# EAGLE schematic NXPESC-UF1_test002 (EAGLE 7.6.0)

## Sheet 1 of 3
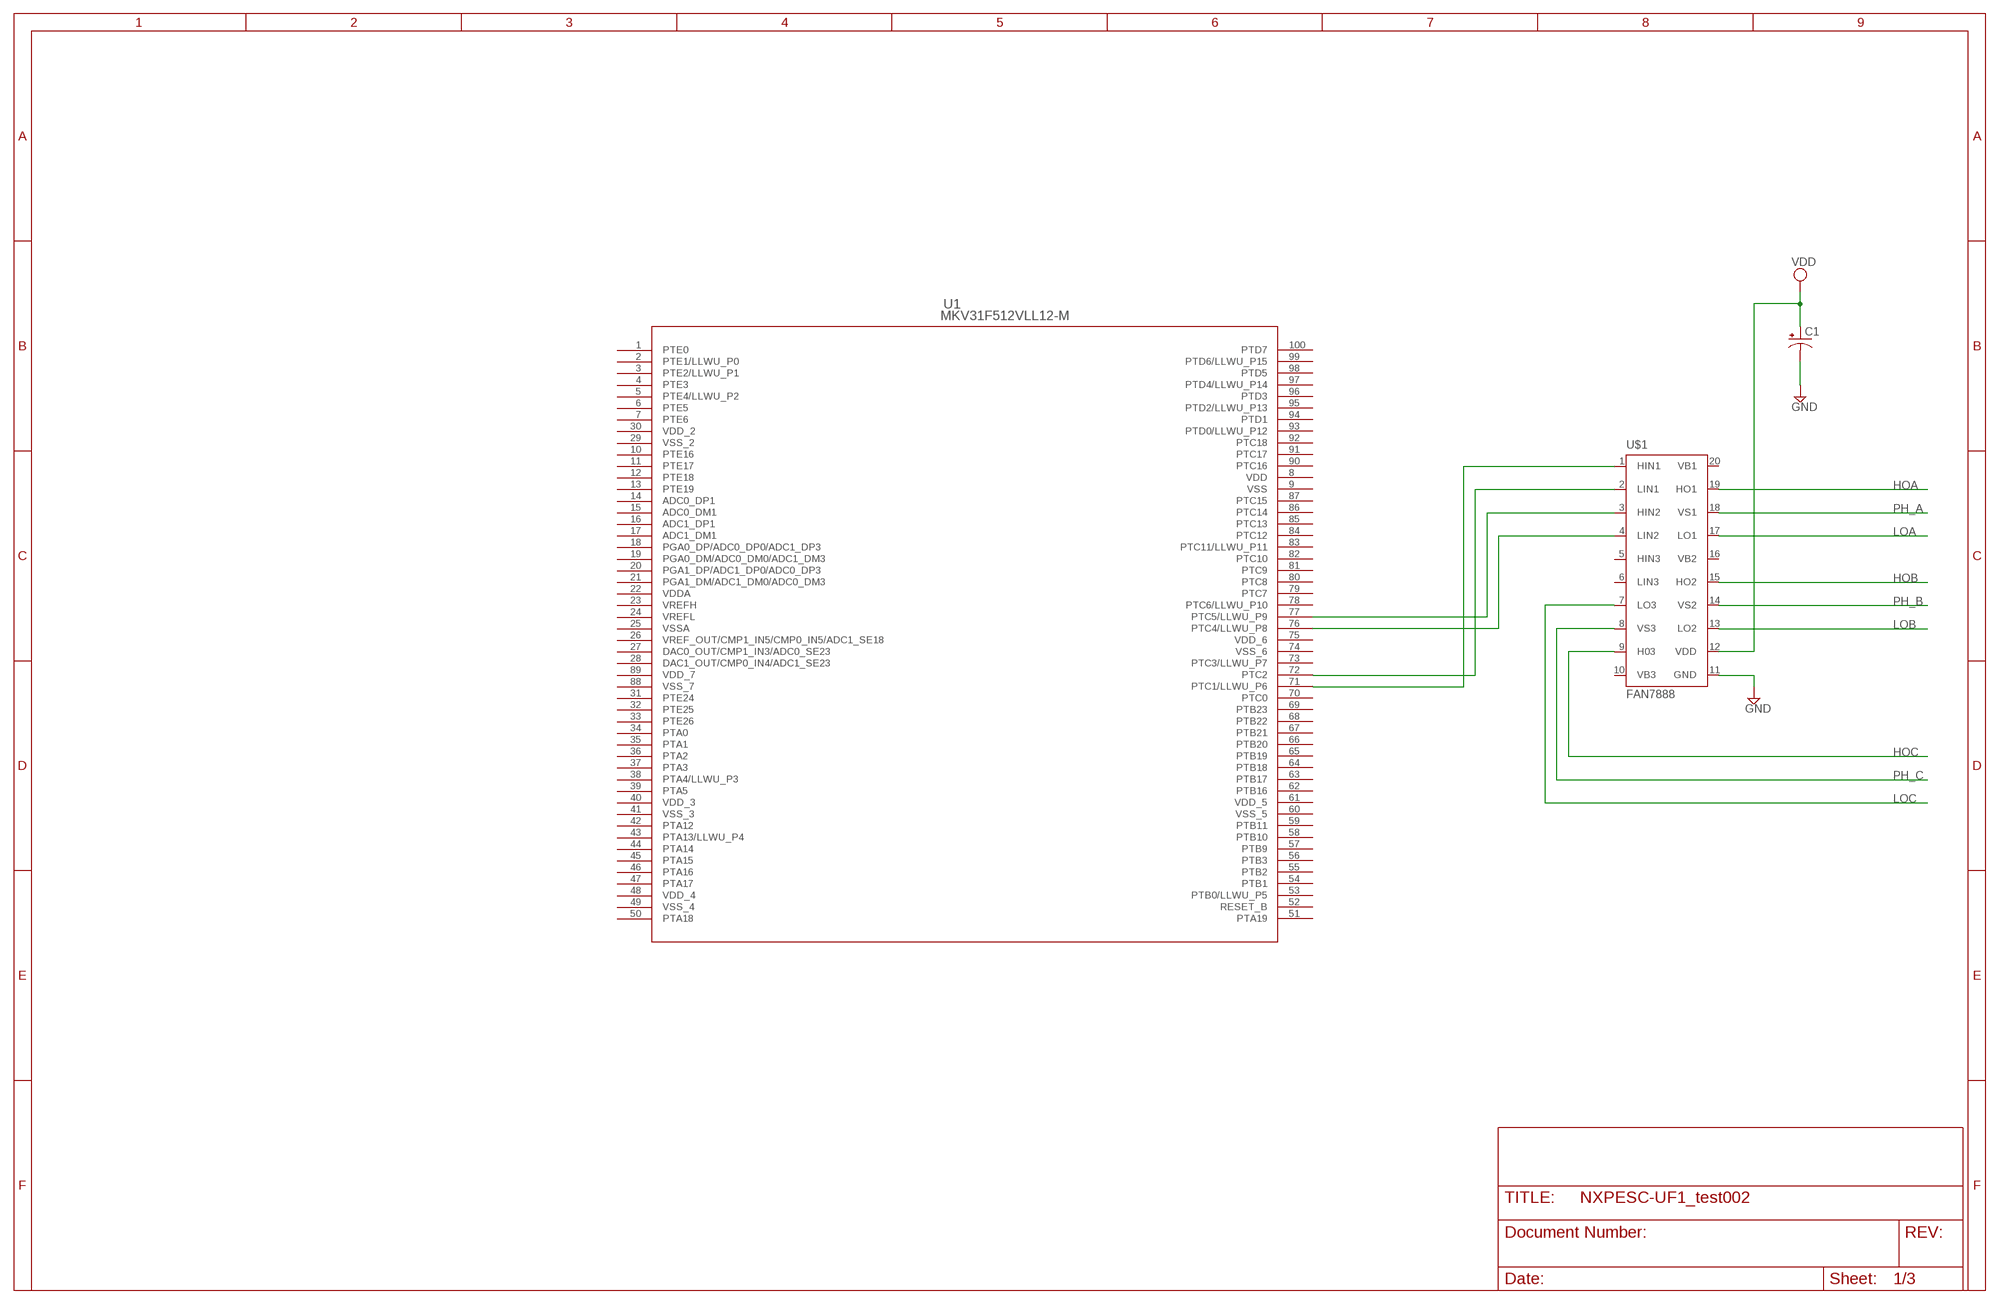
[diagram p0: schematic, sheet 1]

### Parts
C1  CAP_POL1206  [EIA3216]
U1  MKV31F512VLL12-M  [LQFP-100_14X14X1_7-M]
U$1  FAN7888  [SOIC-20]

### Nets
GND: C1.C(-) U$1.11(GND) ; also sheet 2
HOA: U$1.19(HO1) ; also sheet 2
HOB: U$1.15(HO2) ; also sheet 2
HOC: U$1.9(H03) ; also sheet 2
LOA: U$1.17(LO1) ; also sheet 2
LOB: U$1.13(LO2) ; also sheet 2
LOC: U$1.7(LO3) ; also sheet 2
N$5: U1.71(PTC1/LLWU_P6) U$1.1(HIN1)
N$6: U1.72(PTC2) U$1.2(LIN1)
N$7: U1.77(PTC5/LLWU_P9) U$1.3(HIN2)
N$8: U1.76(PTC4/LLWU_P8) U$1.4(LIN2)
PH_A: U$1.18(VS1) ; also sheet 2
PH_B: U$1.14(VS2) ; also sheet 2
PH_C: U$1.8(VS3) ; also sheet 2
VDD: C1.A(+) U$1.12(VDD)
Unconnected: U1.1(PTE0) U1.2(PTE1/LLWU_P0) U1.3(PTE2/LLWU_P1) U1.4(PTE3) U1.5(PTE4/LLWU_P2) U1.6(PTE5) U1.7(PTE6) U1.10(PTE16) U1.11(PTE17) U1.12(PTE18) U1.13(PTE19) U1.14(ADC0_DP1) U1.15(ADC0_DM1) U1.16(ADC1_DP1) U1.17(ADC1_DM1) U1.18(PGA0_DP/ADC0_DP0/ADC1_DP3) U1.19(PGA0_DM/ADC0_DM0/ADC1_DM3) U1.20(PGA1_DP/ADC1_DP0/ADC0_DP3) U1.21(PGA1_DM/ADC1_DM0/ADC0_DM3) U1.26(VREF_OUT/CMP1_IN5/CMP0_IN5/ADC1_SE18) U1.27(DAC0_OUT/CMP1_IN3/ADC0_SE23) U1.28(DAC1_OUT/CMP0_IN4/ADC1_SE23) U1.31(PTE24) U1.32(PTE25) U1.33(PTE26) U1.34(PTA0) U1.35(PTA1) U1.36(PTA2) U1.37(PTA3) U1.38(PTA4/LLWU_P3) U1.39(PTA5) U1.42(PTA12) U1.43(PTA13/LLWU_P4) U1.44(PTA14) U1.45(PTA15) U1.46(PTA16) U1.47(PTA17) U1.50(PTA18) U1.51(PTA19) U1.52(RESET_B) U1.53(PTB0/LLWU_P5) U1.54(PTB1) U1.55(PTB2) U1.56(PTB3) U1.57(PTB9) U1.58(PTB10) U1.59(PTB11) U1.62(PTB16) U1.63(PTB17) U1.64(PTB18) U1.65(PTB19) U1.66(PTB20) U1.67(PTB21) U1.68(PTB22) U1.69(PTB23) U1.70(PTC0) U1.73(PTC3/LLWU_P7) U1.78(PTC6/LLWU_P10) U1.79(PTC7) U1.80(PTC8) U1.81(PTC9) U1.82(PTC10) U1.83(PTC11/LLWU_P11) U1.84(PTC12) U1.85(PTC13) U1.86(PTC14) U1.87(PTC15) U1.90(PTC16) U1.91(PTC17) U1.92(PTC18) U1.93(PTD0/LLWU_P12) U1.94(PTD1) U1.95(PTD2/LLWU_P13) U1.96(PTD3) U1.97(PTD4/LLWU_P14) U1.98(PTD5) U1.99(PTD6/LLWU_P15) U1.100(PTD7) U$1.5(HIN3) U$1.6(LIN3)

## Sheet 2 of 3
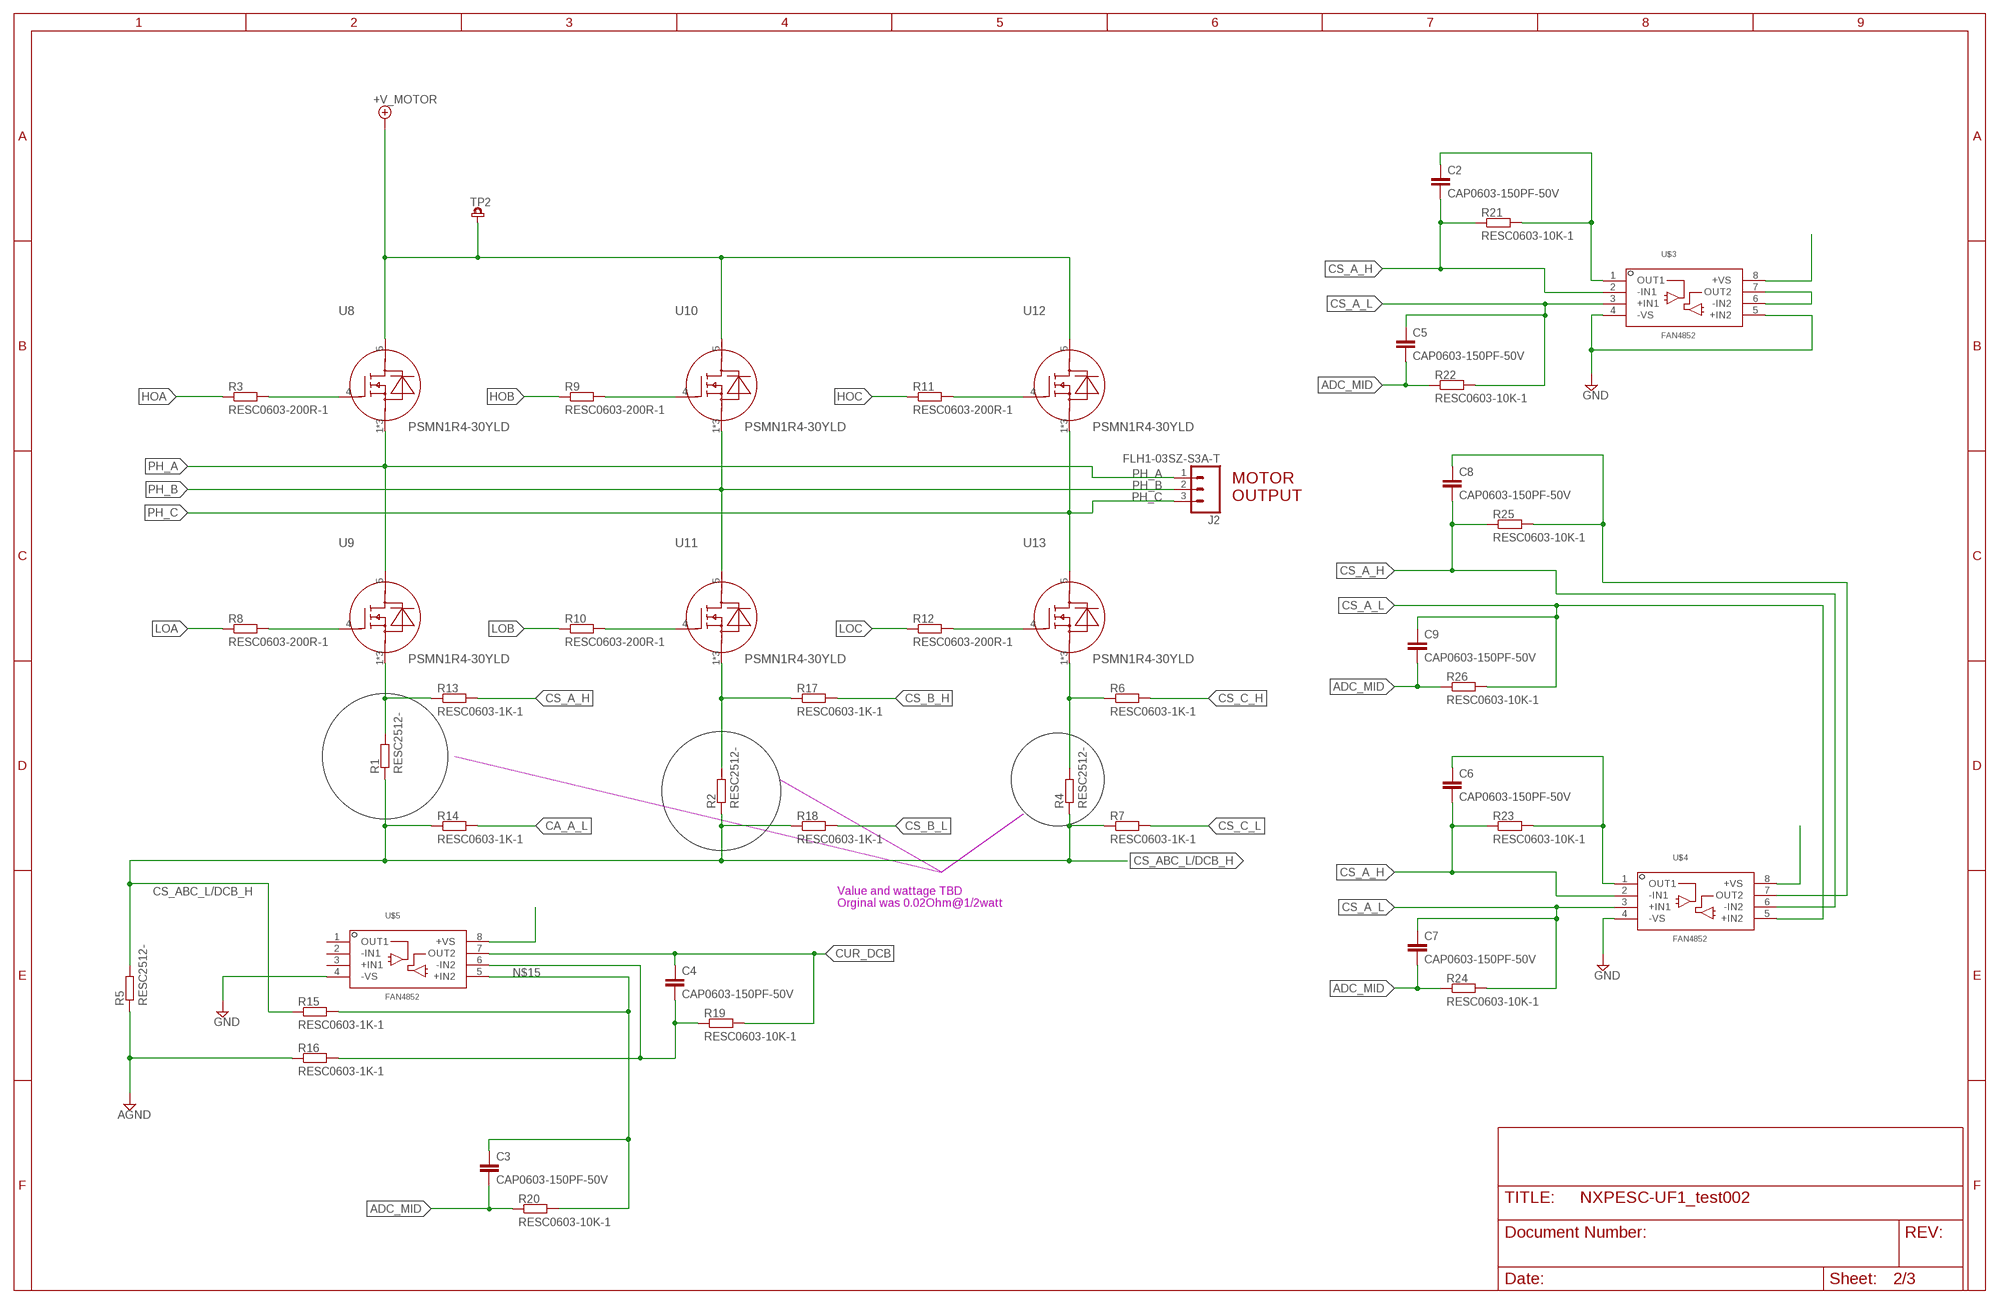
[diagram p1: schematic, sheet 2]

### Parts
C2  CAP0603-150PF-50V  [C0603]
C3  CAP0603-150PF-50V  [C0603]
C4  CAP0603-150PF-50V  [C0603]
C5  CAP0603-150PF-50V  [C0603]
C6  CAP0603-150PF-50V  [C0603]
C7  CAP0603-150PF-50V  [C0603]
C8  CAP0603-150PF-50V  [C0603]
C9  CAP0603-150PF-50V  [C0603]
J2  FLH1-03SZ-S3A-T  [J3]
R1  RESC2512-  [R2512]
R2  RESC2512-  [R2512]
R3  RESC0603-200R-1  [C0603]
R4  RESC2512-  [R2512]
R5  RESC2512-  [R2512]
R6  RESC0603-1K-1  [C0603]
R7  RESC0603-1K-1  [C0603]
R8  RESC0603-200R-1  [C0603]
R9  RESC0603-200R-1  [C0603]
R10  RESC0603-200R-1  [C0603]
R11  RESC0603-200R-1  [C0603]
R12  RESC0603-200R-1  [C0603]
R13  RESC0603-1K-1  [C0603]
R14  RESC0603-1K-1  [C0603]
R15  RESC0603-1K-1  [C0603]
R16  RESC0603-1K-1  [C0603]
R17  RESC0603-1K-1  [C0603]
R18  RESC0603-1K-1  [C0603]
R19  RESC0603-10K-1  [C0603]
R20  RESC0603-10K-1  [C0603]
R21  RESC0603-10K-1  [C0603]
R22  RESC0603-10K-1  [C0603]
R23  RESC0603-10K-1  [C0603]
R24  RESC0603-10K-1  [C0603]
R25  RESC0603-10K-1  [C0603]
R26  RESC0603-10K-1  [C0603]
TP2  TP-TH-SMLL  [TP-SMLL]
U8  PSMN1R4-30YLD  [LFPAK56]
U9  PSMN1R4-30YLD  [LFPAK56]
U10  PSMN1R4-30YLD  [LFPAK56]
U11  PSMN1R4-30YLD  [LFPAK56]
U12  PSMN1R4-30YLD  [LFPAK56]
U13  PSMN1R4-30YLD  [LFPAK56]
U$3  FAN4852  [SOP65P490X110-8N]
U$4  FAN4852  [SOP65P490X110-8N]
U$5  FAN4852  [SOP65P490X110-8N]

### Nets
+V_MOTOR: TP2.1 U8.5(D) U10.5(D) U12.5(D)
ADC_MID: C3.2 C5.2 C7.2 C9.2 R20.1 R22.1 R24.1 R26.1
AGND: R5.1 R16.1
CA_A_L: R14.2
CS_A_H: C2.2 C6.2 C8.2 R13.2 R21.1 R23.1 R25.1 U$3.2(-IN1) U$4.2(-IN1) U$4.6(-IN2)
CS_A_L: C5.1 C7.1 C9.1 R22.2 R24.2 R26.2 U$3.3(+IN1) U$4.3(+IN1) U$4.5(+IN2)
CS_ABC_L/DCB_H: R1.1 R2.1 R4.1 R5.2 R7.1 R14.1 R15.1 R18.1
CS_B_H: R17.2
CS_B_L: R18.2
CS_C_H: R6.2
CS_C_L: R7.2
CUR_DCB: C4.1 R19.2 U$5.7(OUT2)
GND: U$3.4(-VS) U$3.5(+IN2) U$4.4(-VS) U$5.4(-VS) ; also sheet 1
HOA: R3.1 ; also sheet 1
HOB: R9.1 ; also sheet 1
HOC: R11.1 ; also sheet 1
LOA: R8.1 ; also sheet 1
LOB: R10.1 ; also sheet 1
LOC: R12.1 ; also sheet 1
N$1: R3.2 U8.4(G)
N$2: R1.2 R13.1 U9.1(S) U9.2(S) U9.3(S)
N$3: R8.2 U9.4(G)
N$4: R9.2 U10.4(G)
N$9: R10.2 U11.4(G)
N$10: R11.2 U12.4(G)
N$11: R2.2 R17.1 U11.1(S) U11.2(S) U11.3(S)
N$12: R4.2 R6.1 U13.1(S) U13.2(S) U13.3(S)
N$13: U$3.6(-IN2) U$3.7(OUT2)
N$15: C3.1 R15.2 R20.2 U$5.5(+IN2)
N$16: C4.2 R16.2 R19.1 U$5.6(-IN2)
N$17: R12.2 U13.4(G)
N$18: C2.1 R21.2 U$3.1(OUT1)
N$19: U$3.8(+VS)
N$20: U$4.8(+VS)
N$21: C6.1 R23.2 U$4.1(OUT1)
N$22: C8.1 R25.2 U$4.7(OUT2)
N$25: U$5.8(+VS)
PH_A: J2.1 U8.1(S) U8.2(S) U8.3(S) U9.5(D) ; also sheet 1
PH_B: J2.2 U10.1(S) U10.2(S) U10.3(S) U11.5(D) ; also sheet 1
PH_C: J2.3 U12.1(S) U12.2(S) U12.3(S) U13.5(D) ; also sheet 1
Unconnected: U$5.1(OUT1) U$5.2(-IN1) U$5.3(+IN1)

### Notes on the sheet
- MOTOR
  OUTPUT
- Value and wattage TBD
  Orginal was 0.02Ohm@1/2watt

## Sheet 3 of 3
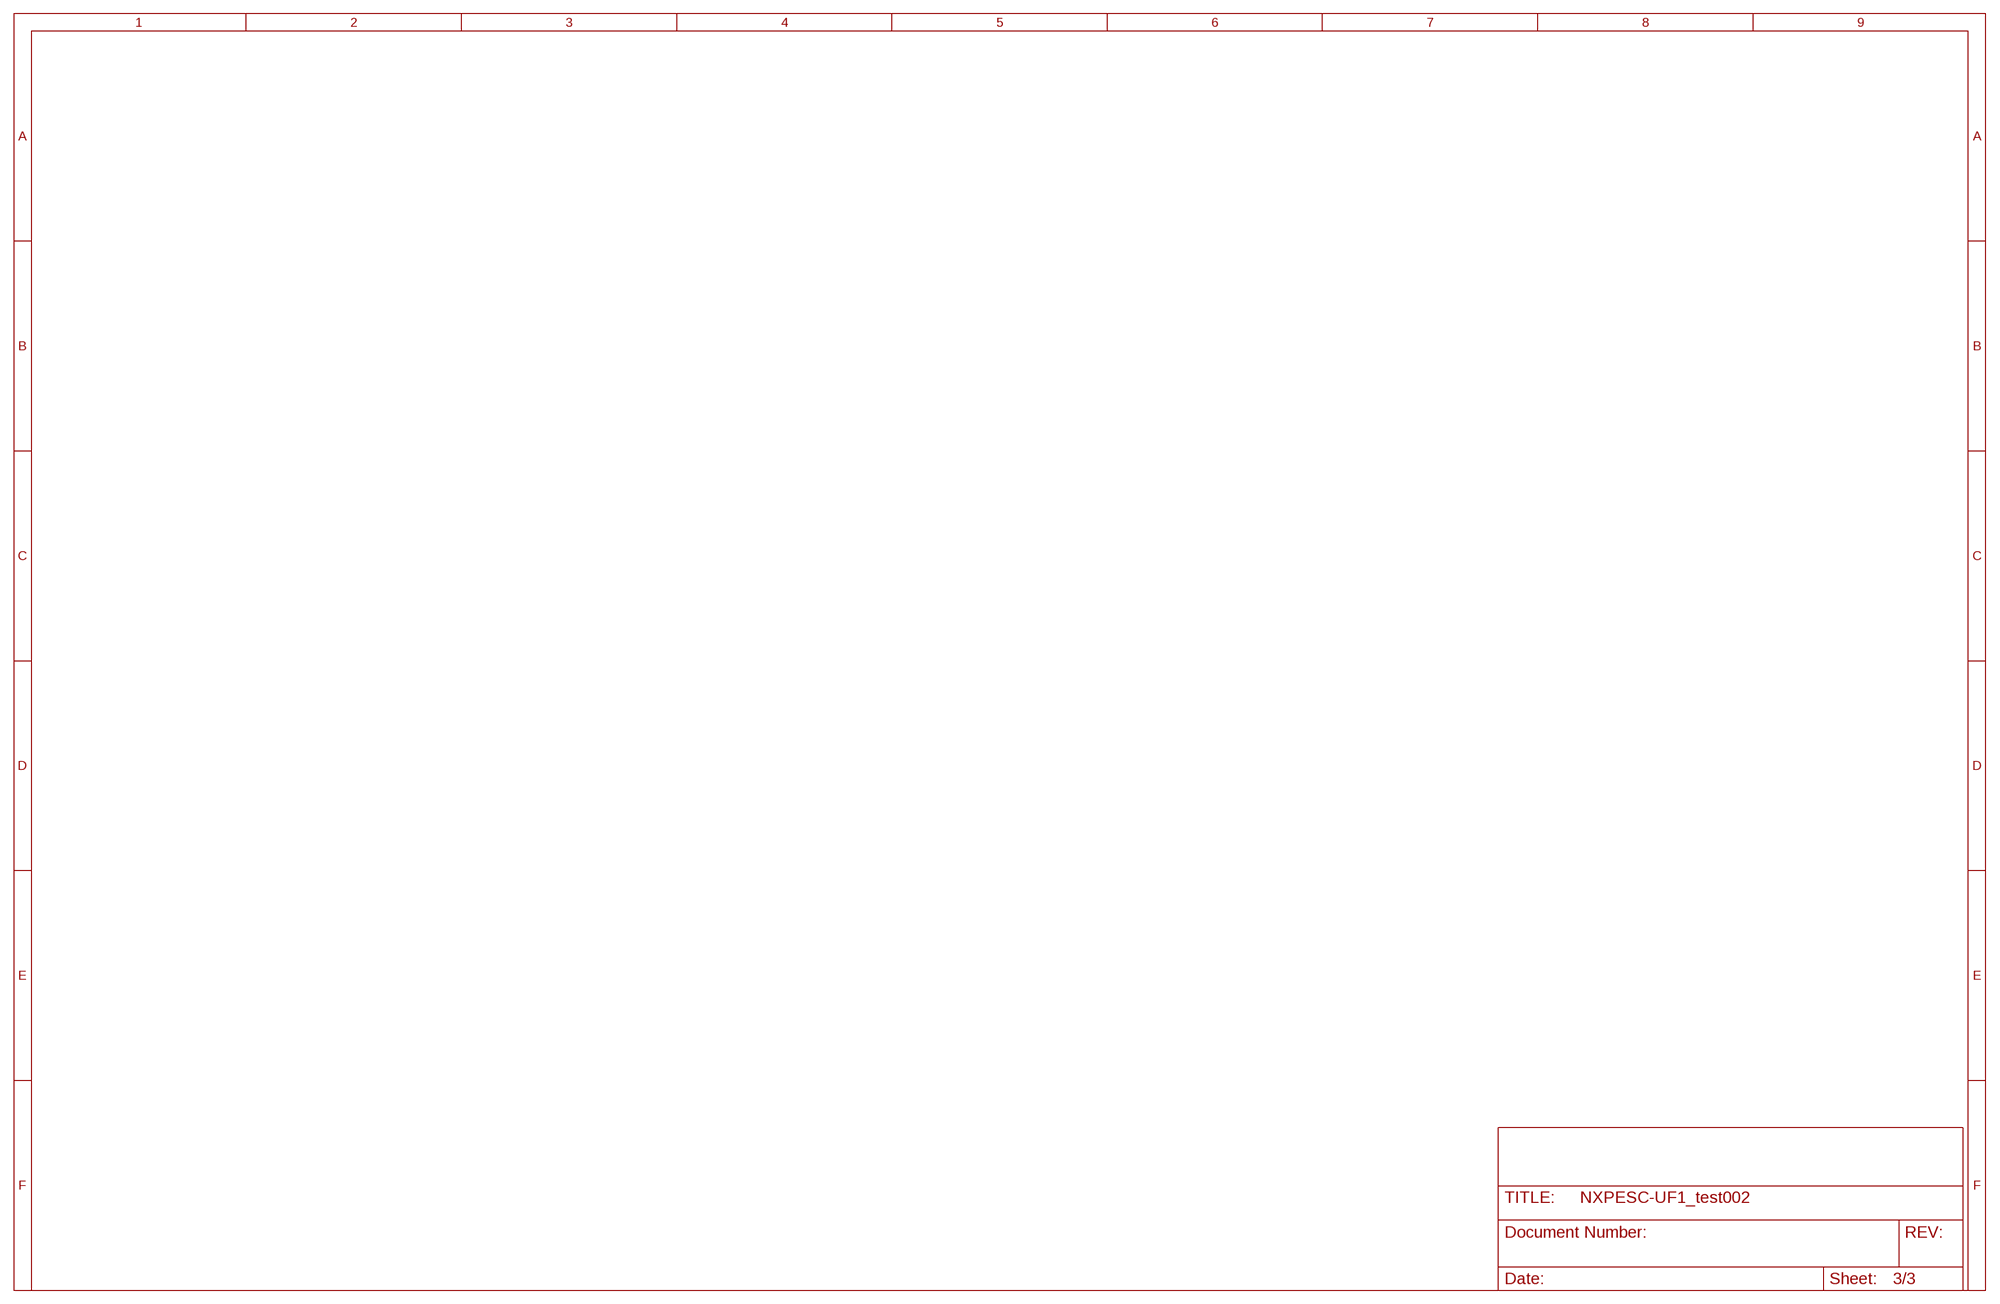
[diagram p2: schematic, sheet 3]

## Power pins joined to a net without a drawn wire
VB1: U$1.20(VB1)
VB2: U$1.16(VB2)
VB3: U$1.10(VB3)
VDD: U1.8(VDD)
VDD_2: U1.30(VDD_2)
VDD_3: U1.40(VDD_3)
VDD_4: U1.48(VDD_4)
VDD_5: U1.61(VDD_5)
VDD_6: U1.75(VDD_6)
VDD_7: U1.89(VDD_7)
VDDA: U1.22(VDDA)
VREFH: U1.23(VREFH)
VREFL: U1.24(VREFL)
VSS: U1.9(VSS)
VSS_2: U1.29(VSS_2)
VSS_3: U1.41(VSS_3)
VSS_4: U1.49(VSS_4)
VSS_5: U1.60(VSS_5)
VSS_6: U1.74(VSS_6)
VSS_7: U1.88(VSS_7)
VSSA: U1.25(VSSA)

## Library data of the parts
C1 = pixhawk2:CAP_POL: Capacitor Polarized These are standard SMD and PTH capacitors. Normally 10uF, 47uF, and 100uF in electrolytic and tantalum varieties. Always verify the external diameter of the through hole cap, it varies with capacity, voltage, and manufacturer. The EIA devices should be standard.
C2-C9 = etc-rcl:CAP?-*: Capacitors with ETC part numbers. package 1812 are actually 1808 Y capacitors
J2 = etc-connector-003a:FLH1-03SZ-S3A-T: Molex 3-pin single row friction lock pin header.
R1-R26 = etc-rcl:RESC?-*: Resistors with ETC part numbers.
TP2 = etc-connector-003a:TP-TH-SMLL
U1 = MKV31F512VLL12:MKV31F512VLL12: The Kinetis KV3x family of MCUs delivers a high-performance solution for BLDC, PMSM and ACIM motor control applications. Built upon the ARM Cortex-M4 core running at 100 or 120 MHz with DSP instruction set and floating point unit, the KV3 devices feature dual 16-bit analog-to-digital converters (ADCs) sampling at up to 1.2 mega samples per second (MSPS) in 12-bit mode, multiple motor control timers, 64 to 512 KB of flash memory and a comprehensive enablement suite from proprietary and third-party resources, including reference designs for ACIM, BLDC and PMSM motor control built on NXP's Embedded Software libraries and motor configuration tools. The KV3x is the first device in the Kinetis V portfolio to be enabled with Kinetis Motor Suite (KMS). KMS is a software solution that enables the rapid configuration of motor drive systems, and accelerates development of the final motor drive application, whilst improving overall motor system performance. KMS simplifies motor control across variable speeds and loads of any type of 3-ph PMSM motor regardless of power level. For more information on Kinetis Motor Suite go to nxp.com/kms
U8-U13 = PSMN1R2-25YL_115:PSMN1R4-30YLD: NXP PSMN1R4
U$1 = FAN7888:FAN7888
U$3-U$5 = NXPHLITE:FAN4852: FAN4852 9MHz Low-Power Dual CMOS Amplifier The FAN4852 is a dual, rail-to-rail output, low-power, CMOS amplifier that consumes only 800µA of supply current, while providing ±50mA of output short-circuit current. This amplifier is designed to operate supplies from 2.5V to 5V. Additionally, the FAN4852 is EMI hardened, which minimizes EMI interference. It has a maximum input offset voltage of 1mV and an input common-mode range that includes ground. The FAN4852 is designed on a CMOS process and provides 9MHz of bandwidth and 6V/µs of slew rate. The combination of low-power, low-voltage operation and a small package make this amplifier well suited for general-purpose and battery-powered applications.